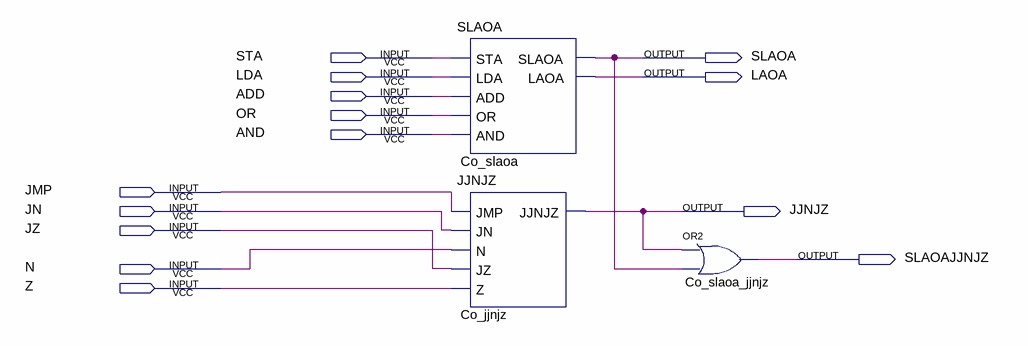
[diagram p0: schematic sheet]
// Quartus schematic SLAOAJJNJZ.bdf as structural Verilog: 3 symbols, 14 pins
module SLAOAJJNJZ (
  input  STA,
  input  LDA,
  input  ADD,
  input  OR,
  input  AND,
  input  JMP,
  input  JN,
  input  JZ,
  input  N,
  input  Z,
  output SLAOA,
  output LAOA,
  output JJNJZ,
  output SLAOAJJNJZ
);

  SLAOA Co_slaoa (.STA(STA), .LDA(LDA), .ADD(ADD), .OR(OR), .AND(AND), .SLAOA(SLAOA), .LAOA(LAOA));
  JJNJZ Co_jjnjz (.JMP(JMP), .JN(JN), .N(N), .JZ(JZ), .Z(Z), .JJNJZ(JJNJZ));
  or Co_slaoa_jjnjz (SLAOAJJNJZ, JJNJZ, SLAOA);
endmodule
